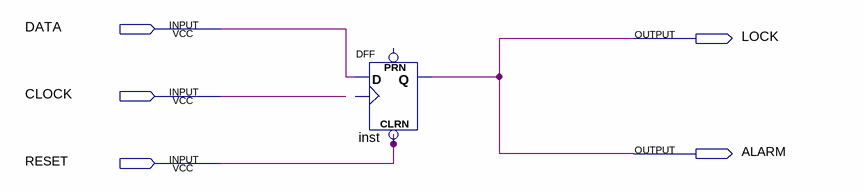
[diagram p0: schematic sheet]
// Quartus schematic test.bdf as structural Verilog: 1 symbols, 5 pins
module test (
  input  DATA,
  input  CLOCK,
  input  RESET,
  output LOCK,
  output ALARM
);

  DFF inst (.CLRN(RESET), .D(DATA), .Q(ALARM));  // open: CLK, PRN

  assign LOCK = ALARM;
endmodule
